# Altium schematic sheet Main.SchDoc: 203 Matrix - Core
size 320 x 193 mm; Revision: FE V1.0
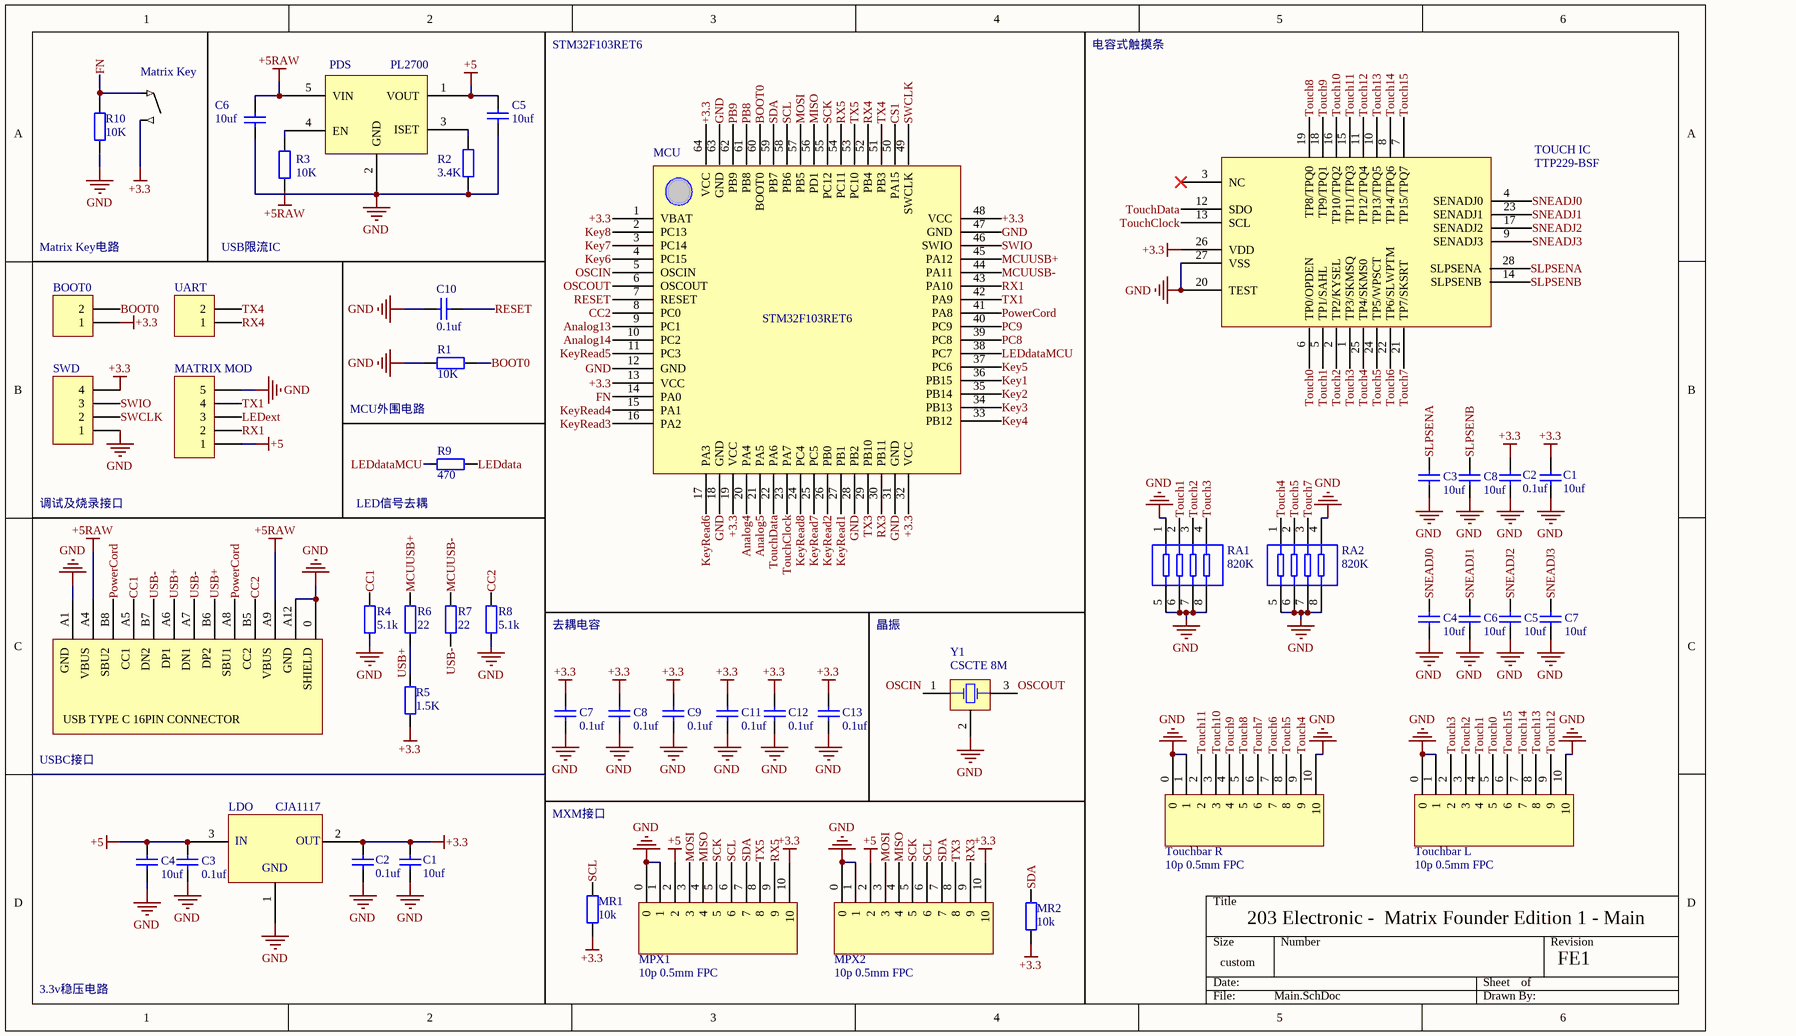
[diagram p0: Main.SchDoc]

## Parts
(Parts that share a designator on the sheet are numbered #1, #2 ... from top to bottom, then left to right.)
BOOT0  MHDR1X2  [HDR1X2]  (value not drawn)
C1#1  value 10uf  [0603 res]  (hidden comment: Touch Bar)
C1#2  value 10uf  [0603 res]  (hidden comment: LDO)
C2#1  value 0.1uf  [0603 res]  (hidden comment: Touch Bar)
C2#2  value 0.1uf  [0603 res]  (hidden comment: LDO)
C3#1  value 10uf  [0603 res]  (hidden comment: Touch Bar)
C3#2  value 0.1uf  [0603 res]  (hidden comment: LDO)
C4#1  value 10uf  [0603 res]  (hidden comment: Touch Bar)
C4#2  value 10uf  [0603 res]  (hidden comment: LDO)
C5#1  value 10uf  [0603 res]  (hidden comment: PDS)
C5#2  value 10uf  [0603 res]  (hidden comment: Touch Bar)
C6#1  value 10uf  [0603 res]  (hidden comment: PDS)
C6#2  value 10uf  [0603 res]  (hidden comment: Touch Bar)
C7#1  value 10uf  [0603 res]  (hidden comment: Touch Bar)
C7#2  value 0.1uf  [0603 res]  (hidden comment: MCU)
C8#1  value 10uf  [0603 res]  (hidden comment: Touch Bar)
C8#2  value 0.1uf  [0603 res]  (hidden comment: MCU)
C9  value 0.1uf  [0603 res]  (hidden comment: MCU)
C10  value 0.1uf  [0603 res]  (hidden comment: MCU)
C11  value 0.1uf  [0603 res]  (hidden comment: MCU)
C12  value 0.1uf  [0603 res]  (hidden comment: MCU)
C13  value 0.1uf  [0603 res]  (hidden comment: MCU)
LDO  CJA1117  [SOT89-3L]
Matrix_Key  Comment  [sw5x5]  (value not drawn)
MATRIX_MOD  MHDR1X5  [MHDR1X5]  (value not drawn)
MCU  RET6  [STM-LQFP64_L]  (value not drawn)
MPX1  10p 0.5mm FPC  [10P FPC 0.5mm]
MPX2  10p 0.5mm FPC  [10P FPC 0.5mm]
MR1  value 10k  [0603 res]  (hidden comment: System)
MR2  value 10k  [0603 res]  (hidden comment: System)
PDS  PL2700  [SOT23-5]
R1  value 10K  [0603 res]  (hidden comment: MCU)
R2  value 3.4K  [0603 res]  (hidden comment: PDS)
R3  value 10K  [0603 res]  (hidden comment: PDS)
R4  value 5.1k  [0603 res]  (hidden comment: MCU)
R5  value 1.5K  [0603 res]  (hidden comment: MCU)
R6  value 22  [0603 res]  (hidden comment: MCU)
R7  value 22  [0603 res]  (hidden comment: MCU)
R8  value 5.1k  [0603 res]  (hidden comment: MCU)
R9  value 470  [1206]  (hidden comment: LED)
R10  value 10K  [0603 res]  (hidden comment: Matrix Key)
RA1  value 820K  [8P4R]  (hidden comment: Touch Bar)
RA2  value 820K  [8P4R]  (hidden comment: Touch Bar)
SWD  SWD  [HDR1X4]  (value not drawn)
TOUCH_IC  TTP229-BSF  [SSOP-28]
Touchbar_L  10p 0.5mm FPC  [10P FPC 0.5mm]
Touchbar_R  10p 0.5mm FPC  [10P FPC 0.5mm]
UART  Comment  [HDR1X2]  (value not drawn)
USB-C  USBC 16PIN  [USBC 16PIN -1.6]  (value not drawn)
Y1  CSCTE 8M  [CSTCE]

## Nets
+3.3: BOOT0.1 C1#1.2 C1#2.1 C2#1.2 C2#2.1 C7#2.2 C8#2.2 C9.2 C11.2 C12.2 C13.2 LDO.2 Matrix_Key.2(Out) MCU.1(VBAT) MCU.13(VCC) MCU.19(VCC) MCU.32(VCC) MCU.48(VCC) MCU.64(VCC) MPX1.10 MPX2.10 MR1.1 MR2.1 R5.2 SWD.4 TOUCH_IC.26(VDD)
+5: C3#2.2 C4#2.2 C5#1.1 LDO.3 MATRIX_MOD.1 MPX1.2 MPX2.2 PDS.1(VOUT)
+5RAW: C6#1.1 PDS.5(VIN) R3.1 USB-C.A4 USB-C.A9
GND: C1#1.1 C1#2.2 C2#1.1 C2#2.2 C3#1.1 C3#2.1 C4#1.1 C4#2.1 C5#1.2 C5#2.1 C6#1.2 C6#2.1 C7#1.1 C7#2.1 C8#1.1 C8#2.1 C9.1 C10.2 C11.1 C12.1 C13.1 LDO.1 MATRIX_MOD.5 MCU.12(GND) MCU.18(GND) MCU.28(PB2) MCU.31(GND) MCU.47(GND) MCU.63(GND) MPX1.0 MPX1.1 MPX2.0 MPX2.1 PDS.2(GND) R1.2 R2.1 R4.2 R8.1 R10.2 RA1.1 RA1.5 RA1.6 RA1.7 RA1.8 RA2.4 RA2.5 RA2.6 RA2.7 RA2.8 SWD.1 TOUCH_IC.20(TEST) TOUCH_IC.27(VSS) Touchbar_L.0 Touchbar_L.1 Touchbar_L.10 Touchbar_R.0 Touchbar_R.1 Touchbar_R.10 USB-C.0 USB-C.A1 USB-C.A12 Y1.2(NC)
Analog4: MCU.20(PA4)
Analog5: MCU.21(PA5)
Analog13: MCU.9(PC1)
Analog14: MCU.10(PC2)
BOOT0: BOOT0.2 MCU.60(BOOT0) R1.1
CC1: R4.1 USB-C.A5
CC2: MCU.8(PC0) R8.2 USB-C.B5
CS1: MCU.50(PA15)
FN: Matrix_Key.1 MCU.14(PA0) R10.1
Key1: MCU.36(PB15)
Key2: MCU.35(PB14)
Key3: MCU.34(PB13)
Key4: MCU.33(PB12)
Key5: MCU.37(PC6)
Key6: MCU.4(PC15)
Key7: MCU.3(PC14)
Key8: MCU.2(PC13)
KeyRead1: MCU.27(PB1)
KeyRead2: MCU.26(PB0)
KeyRead3: MCU.16(PA2)
KeyRead4: MCU.15(PA1)
KeyRead5: MCU.11(PC3)
KeyRead6: MCU.17(PA3)
KeyRead7: MCU.25(PC5)
KeyRead8: MCU.24(PC4)
LEDdata: R9.1
LEDdataMCU: MCU.38(PC7) R9.2
LEDext: MATRIX_MOD.3
MCUUSB+: MCU.45(PA12) R6.2
MCUUSB-: MCU.44(PA11) R7.2
MISO: MCU.56(PD1) MPX1.4 MPX2.4
MOSI: MCU.57(PB5) MPX1.3 MPX2.3
OSCIN: MCU.5(OSCIN) Y1.1(OSC1)
OSCOUT: MCU.6(OSCOUT) Y1.3(OSC2)
PB8: MCU.61(PB8)
PB9: MCU.62(PB9)
PC8: MCU.39(PC8)
PC9: MCU.40(PC9)
PowerCord: MCU.41(PA8) USB-C.A8 USB-C.B8
RESET: C10.1 MCU.7(RESET)
RX1: MATRIX_MOD.2 MCU.43(PA10)
RX3: MCU.30(PB11) MPX2.9
RX4: MCU.52(PB4) UART.1
RX5: MCU.54(PC11) MPX1.9
SCK: MCU.55(PC12) MPX1.5 MPX2.5
SCL: MCU.58(PB6) MPX1.6 MPX2.6 MR1.2
SDA: MCU.59(PB7) MPX1.7 MPX2.7 MR2.2
SLPSENA: C3#1.2 TOUCH_IC.28(SLPSENA)
SLPSENB: C8#1.2 TOUCH_IC.14(SLPSENB)
SNEADJ0: C4#1.2 TOUCH_IC.4(SENADJ0)
SNEADJ1: C6#2.2 TOUCH_IC.23(SENADJ1)
SNEADJ2: C5#2.2 TOUCH_IC.17(SENADJ2)
SNEADJ3: C7#1.2 TOUCH_IC.9(SENADJ3)
SWCLK: MCU.49(SWCLK) SWD.2
SWIO: MCU.46(SWIO) SWD.3
Touch0: TOUCH_IC.6(TP0/OPDEN) Touchbar_L.5
Touch1: RA1.2 TOUCH_IC.5(TP1/SAHL) Touchbar_L.4
Touch2: RA1.3 TOUCH_IC.2(TP2/KYSEL) Touchbar_L.3
Touch3: RA1.4 TOUCH_IC.1(TP3/SKMSQ) Touchbar_L.2
Touch4: RA2.1 TOUCH_IC.25(TP4/SKMS0) Touchbar_R.9
Touch5: RA2.2 TOUCH_IC.24(TP5/WPSCT) Touchbar_R.8
Touch6: TOUCH_IC.22(TP6/SLWPTM) Touchbar_R.7
Touch7: RA2.3 TOUCH_IC.21(TP7/SKSRT) Touchbar_R.6
Touch8: TOUCH_IC.19(TP8/TPQ0) Touchbar_R.5
Touch9: TOUCH_IC.18(TP9/TPQ1) Touchbar_R.4
Touch10: TOUCH_IC.16(TP10/TPQ2) Touchbar_R.3
Touch11: TOUCH_IC.15(TP11/TPQ3) Touchbar_R.2
Touch12: TOUCH_IC.11(TP12/TPQ4) Touchbar_L.9
Touch13: TOUCH_IC.10(TP13/TPQ5) Touchbar_L.8
Touch14: TOUCH_IC.8(TP14/TPQ6) Touchbar_L.7
Touch15: TOUCH_IC.7(TP15/TPQ7) Touchbar_L.6
TouchClock: MCU.23(PA7) TOUCH_IC.13(SCL)
TouchData: MCU.22(PA6) TOUCH_IC.12(SDO)
TX1: MATRIX_MOD.4 MCU.42(PA9)
TX3: MCU.29(PB10) MPX2.8
TX4: MCU.51(PB3) UART.2
TX5: MCU.53(PC10) MPX1.8
USB+: R5.1 R6.1 USB-C.A6 USB-C.B6
USB-: R7.1 USB-C.A7 USB-C.B7
NetPDS_3: PDS.3(ISET) R2.2
NetPDS_4: PDS.4(EN) R3.2

Not connected (* = marked no-connect by the designer): TOUCH_IC 3(NC)*

## Notes on the sheet
- STM32F103RET6
- 电容式触摸条
- Matrix Key电路
- USB限流IC
- MCU外围电路
- 调试及烧录接口
- (near R9) LED信号去耦
- 去耦电容
- 晶振
- USBC接口
- MXM接口
- 203 Electronic -  Matrix Founder Edition 1 - Main
- FE1
- 3.3v稳压电路
- (in symbol CJA1117) IN; OUT; GND
- (in symbol RET6) STM32F103RET6
- (in symbol USBC 16PIN) GND; VBUS; SBU2; CC1; DN2; DP1; DN1; DP2; SBU1; CC2; SHIELD; USB TYPE C 16PIN CONNECTOR

## Library data of the parts
BOOT0 UART = MHDR1X2: MCU; LatestRevisionDate: 17-Jul-2002; LatestRevisionNote: Re-released for DXP Platform.; Publisher: Altium Limited
C1#1 C2#1 C3#1 C4#1 C5#2 C6#2 C7#1 C8#1 = Cap: Needs to be NR0; Published: 8-Jun-2000; LatestRevisionDate: 17-Jul-2002; LatestRevisionNote: Re-released for DXP Platform.; PackageReference: RAD-0.3; Publisher: Altium Limited; PackageDescription: Radial Cap, Thru-Hole; 2 Leads; 0.3 in Pin Spacing
C1#2 C2#2 C3#2 C4#2 C5#1 C6#1 C7#2 C8#2 C9-C13 = Cap: Published: 8-Jun-2000; LatestRevisionDate: 17-Jul-2002; LatestRevisionNote: Re-released for DXP Platform.; PackageReference: RAD-0.3; Publisher: Altium Limited; PackageDescription: Radial Cap, Thru-Hole; 2 Leads; 0.3 in Pin Spacing
LDO = CJA1117: LDO
Matrix_Key = SW: System
MATRIX_MOD = MHDR1X5: MCU; LatestRevisionDate: 17-Jul-2002; LatestRevisionNote: Re-released for DXP Platform.; Publisher: Altium Limited
MCU = RET6: MCU
MPX1 MPX2 = 10 pin fpc: MXM
MR1 MR2 = Res2: MXM; Published: 8-Jun-2000; LatestRevisionDate: 17-Jul-2002; LatestRevisionNote: Re-released for DXP Platform.; PackageReference: AXIAL-0.4; Publisher: Altium Limited; PackageDescription: Axial Device, Thru-Hole; 2 Leads; 0.4 in Pin Spacing
PDS = PL2700: LDO
R1-R10 = Res2: Published: 8-Jun-2000; LatestRevisionDate: 17-Jul-2002; LatestRevisionNote: Re-released for DXP Platform.; PackageReference: AXIAL-0.4; Publisher: Altium Limited; PackageDescription: Axial Device, Thru-Hole; 2 Leads; 0.4 in Pin Spacing
RA1 RA2 = 4R8P Resistor
SWD = Header 4: MCU; LatestRevisionDate: 17-Jul-2002; LatestRevisionNote: Re-released for DXP Platform.; Publisher: Altium Limited
Touchbar_L Touchbar_R = 10 pin fpc: Touch Bar
USB-C = USBC 16PIN: MCU
Y1 = CSCTE: Value: 8Mhz
TOUCH_IC = TTP229-BSF: Value: TTP229-BSF